# Altium project Kanaloa_v2.0.0_Motor.PrjPcb
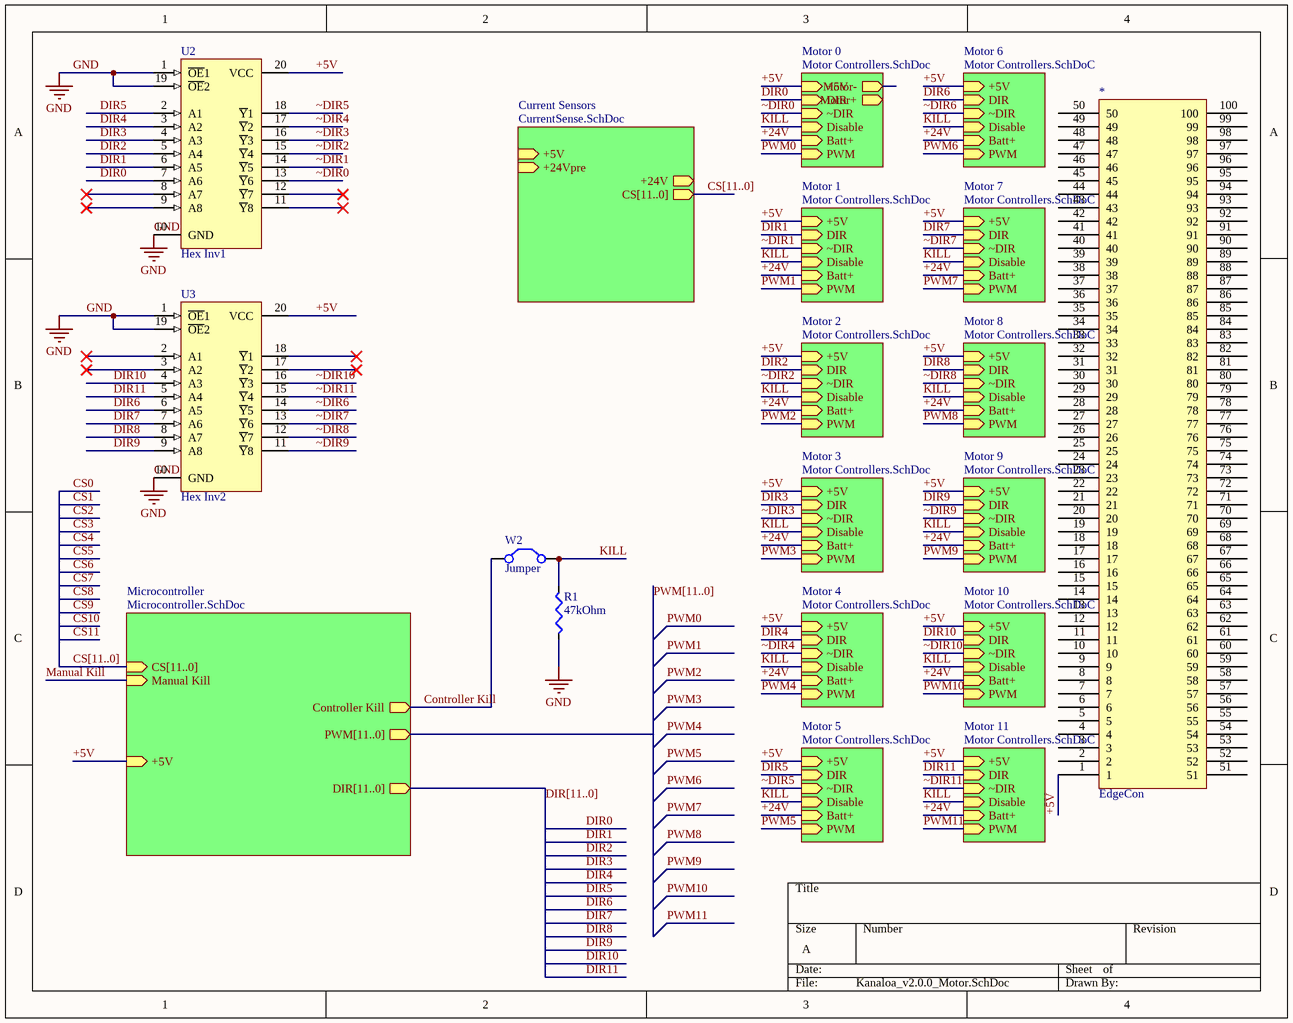
[diagram p0: Kanaloa_v2.0.0_Motor.SchDoc]
4 sheets, 223 parts. Net scope: hierarchical (ports join the sheet entries above them; power ports are global).
Board file: Kanaloa_v2.0.0_Motor.PcbDoc
Sheets:
  Kanaloa_v2.0.0_Motor.SchDoc
    Microcontroller = Microcontroller.SchDoc
    Current Sensors = CurrentSense.SchDoc
    Motor 0 = Motor Controllers.SchDoc
    Motor 6 = Motor Controllers.SchDoc
    Motor 1 = Motor Controllers.SchDoc
    Motor 7 = Motor Controllers.SchDoc
    Motor 2 = Motor Controllers.SchDoc
    Motor 8 = Motor Controllers.SchDoc
    Motor 3 = Motor Controllers.SchDoc
    Motor 9 = Motor Controllers.SchDoc
    Motor 4 = Motor Controllers.SchDoc
    Motor 10 = Motor Controllers.SchDoc
    Motor 5 = Motor Controllers.SchDoc
    Motor 11 = Motor Controllers.SchDoc

## Sheet Kanaloa_v2.0.0_Motor.SchDoc
size A

### Parts
*  EdgeCon  [5645235-3 CON]
R1  47kOhm  [R 1210 (3225) RESISTOR]
U2  Hex Inv1  [DW020_N]
U3  Hex Inv2  [DW020_N]
W2  Jumper  [RAD-0.2]

### Sub-sheets
Current Sensors = CurrentSense.SchDoc: +5V (in), +24Vpre (in), +24V (out), CS[11..0] (out)
Microcontroller = Microcontroller.SchDoc: PWM[11..0] (out), DIR[11..0] (out), +5V (in), Controller Kill (out), Manual Kill (in), CS[11..0] (in)
Motor 0 = Motor Controllers.SchDoc: +5V (in), DIR (in), ~DIR (in), Disable (in), Batt+ (in), PWM (in), Motor- (out), Motor+ (out)
Motor 1 = Motor Controllers.SchDoc: +5V (in), DIR (in), ~DIR (in), Disable (in), Batt+ (in), PWM (in)
Motor 2 = Motor Controllers.SchDoc: +5V (in), DIR (in), ~DIR (in), Disable (in), Batt+ (in), PWM (in)
Motor 3 = Motor Controllers.SchDoc: +5V (in), DIR (in), ~DIR (in), Disable (in), Batt+ (in), PWM (in)
Motor 4 = Motor Controllers.SchDoc: +5V (in), DIR (in), ~DIR (in), Disable (in), Batt+ (in), PWM (in)
Motor 5 = Motor Controllers.SchDoc: +5V (in), DIR (in), ~DIR (in), Disable (in), Batt+ (in), PWM (in)
Motor 6 = Motor Controllers.SchDoC: +5V (in), DIR (in), ~DIR (in), Disable (in), Batt+ (in), PWM (in)
Motor 7 = Motor Controllers.SchDoC: +5V (in), DIR (in), ~DIR (in), Disable (in), Batt+ (in), PWM (in)
Motor 8 = Motor Controllers.SchDoC: +5V (in), DIR (in), ~DIR (in), Disable (in), Batt+ (in), PWM (in)
Motor 9 = Motor Controllers.SchDoC: +5V (in), DIR (in), ~DIR (in), Disable (in), Batt+ (in), PWM (in)
Motor 10 = Motor Controllers.SchDoC: +5V (in), DIR (in), ~DIR (in), Disable (in), Batt+ (in), PWM (in)
Motor 11 = Motor Controllers.SchDoC: +5V (in), DIR (in), ~DIR (in), Disable (in), Batt+ (in), PWM (in)

### Nets
GND: R1.1 U2.1(~{OE}1) U2.10(GND) U2.19(~{OE}2) U3.1(~{OE}1) U3.10(GND) U3.19(~{OE}2)  [project net +5V]
+5V: *.1 U2.20(VCC) U3.20(VCC) ; sheet Microcontroller/+5V, sheet Motor 0/+5V, sheet Motor 6/+5V, sheet Motor 1/+5V, sheet Motor 7/+5V, sheet Motor 2/+5V, sheet Motor 8/+5V, sheet Motor 3/+5V, sheet Motor 9/+5V, sheet Motor 4/+5V, sheet Motor 10/+5V, sheet Motor 5/+5V, sheet Motor 11/+5V
+24V: sheet Motor 0/Batt+, sheet Motor 6/Batt+, sheet Motor 1/Batt+, sheet Motor 7/Batt+, sheet Motor 2/Batt+, sheet Motor 8/Batt+, sheet Motor 3/Batt+, sheet Motor 9/Batt+, sheet Motor 4/Batt+, sheet Motor 10/Batt+, sheet Motor 5/Batt+, sheet Motor 11/Batt+
Controller Kill: W2.1(C1) ; sheet Microcontroller/Controller Kill
DIR0: U2.7(A6) ; sheet Motor 0/DIR
DIR1: U2.6(A5) ; sheet Motor 1/DIR
DIR2: U2.5(A4) ; sheet Motor 2/DIR
DIR3: U2.4(A3) ; sheet Motor 3/DIR
DIR4: U2.3(A2) ; sheet Motor 4/DIR
DIR5: U2.2(A1) ; sheet Motor 5/DIR
DIR6: U3.6(A5) ; sheet Motor 6/DIR
DIR7: U3.7(A6) ; sheet Motor 7/DIR
DIR8: U3.8(A7) ; sheet Motor 8/DIR
DIR9: U3.9(A8) ; sheet Motor 9/DIR
DIR10: U3.4(A3) ; sheet Motor 10/DIR
DIR11: U3.5(A4) ; sheet Motor 11/DIR
KILL: R1.2 W2.2(C2) ; sheet Motor 0/Disable, sheet Motor 6/Disable, sheet Motor 1/Disable, sheet Motor 7/Disable, sheet Motor 2/Disable, sheet Motor 8/Disable, sheet Motor 3/Disable, sheet Motor 9/Disable, sheet Motor 4/Disable, sheet Motor 10/Disable, sheet Motor 5/Disable, sheet Motor 11/Disable
Manual Kill: sheet Microcontroller/Manual Kill
PWM0: sheet Motor 0/PWM
PWM1: sheet Motor 1/PWM
PWM2: sheet Motor 2/PWM
PWM3: sheet Motor 3/PWM
PWM4: sheet Motor 4/PWM
PWM5: sheet Motor 5/PWM
PWM6: sheet Motor 6/PWM
PWM7: sheet Motor 7/PWM
PWM8: sheet Motor 8/PWM
PWM9: sheet Motor 9/PWM
PWM10: sheet Motor 10/PWM
PWM11: sheet Motor 11/PWM
~DIR0: U2.13(~{Y}6) ; sheet Motor 0/~DIR
~DIR1: U2.14(~{Y}5) ; sheet Motor 1/~DIR
~DIR2: U2.15(~{Y}4) ; sheet Motor 2/~DIR
~DIR3: U2.16(~{Y}3) ; sheet Motor 3/~DIR
~DIR4: U2.17(~{Y}2) ; sheet Motor 4/~DIR
~DIR5: U2.18(~{Y}1) ; sheet Motor 5/~DIR
~DIR6: U3.14(~{Y}5) ; sheet Motor 6/~DIR
~DIR7: U3.13(~{Y}6) ; sheet Motor 7/~DIR
~DIR8: U3.12(~{Y}7) ; sheet Motor 8/~DIR
~DIR9: U3.11(~{Y}8) ; sheet Motor 9/~DIR
~DIR10: U3.16(~{Y}3) ; sheet Motor 10/~DIR
~DIR11: U3.15(~{Y}4) ; sheet Motor 11/~DIR

Not connected (* = marked no-connect by the designer): * 2 3 4 5 6 7 8 9 10 11 12 13 14 15 16 17 18 19 20 21 22 23 24 25 26 27 28 29 30 31 32 33 34 35 36 37 38 39 40 41 42 43 44 45 46 47 48 49 50 51 52 53 54 55 56 57 58 59 60 61 62 63 64 65 66 67 68 69 70 71 72 73 74 75 76 77 78 79 80 81 82 83 84 85 86 87 88 89 90 91 92 93 94 95 96 97 98 99 100; U2 8(A7)* 9(A8)* 11(~{Y}8)* 12(~{Y}7)*; U3 2(A1)* 3(A2)* 17(~{Y}2)* 18(~{Y}1)*

### Buses and harness runs
bus CS[11..0] = sheet Current Sensors/CS[11..0]
bus CS[11..0] = sheet Microcontroller/CS[11..0]
bus DIR[11..0] = sheet Microcontroller/DIR[11..0]
bus PWM[11..0] = sheet Microcontroller/PWM[11..0]

### Library data of the parts
R1 = Resistor: Value: 0Ohm
U2 U3 = SN74HCT540DW: Octal Buffer and Line Driver with 3-State Outputs; Published: 8-Jun-2000; LatestRevisionDate: 13-Apr-2006; LatestRevisionNote: IPC-7351 Footprint Added.; DatasheetVersion: May-1997; PackageVersion: Mar-2000; PackageReference: DW020; Publisher: Altium Limited; PackageDescription: 20-Pin Plastic Small Outline Integrated Circuit 1.27 mm Pitch; Code_JEDEC: MS-013; Code_IPC: SOIC127P1030-20; ComponentLink1Description: Manufacturer Link; ComponentLink1URL: http://www.ti.com/; ComponentLink2Description: Datasheet; ComponentLink2URL: http://www-s.ti.com/sc/ds/sn74hct540.pdf
W2 = Jumper: Jumper Wire; Published: 24-Mar-1999; LatestRevisionDate: 17-Jul-2002; LatestRevisionNote: Re-released for DXP Platform.; PackageReference: RAD-0.2; Publisher: Altium Limited

## Sheet Microcontroller.SchDoc
size A
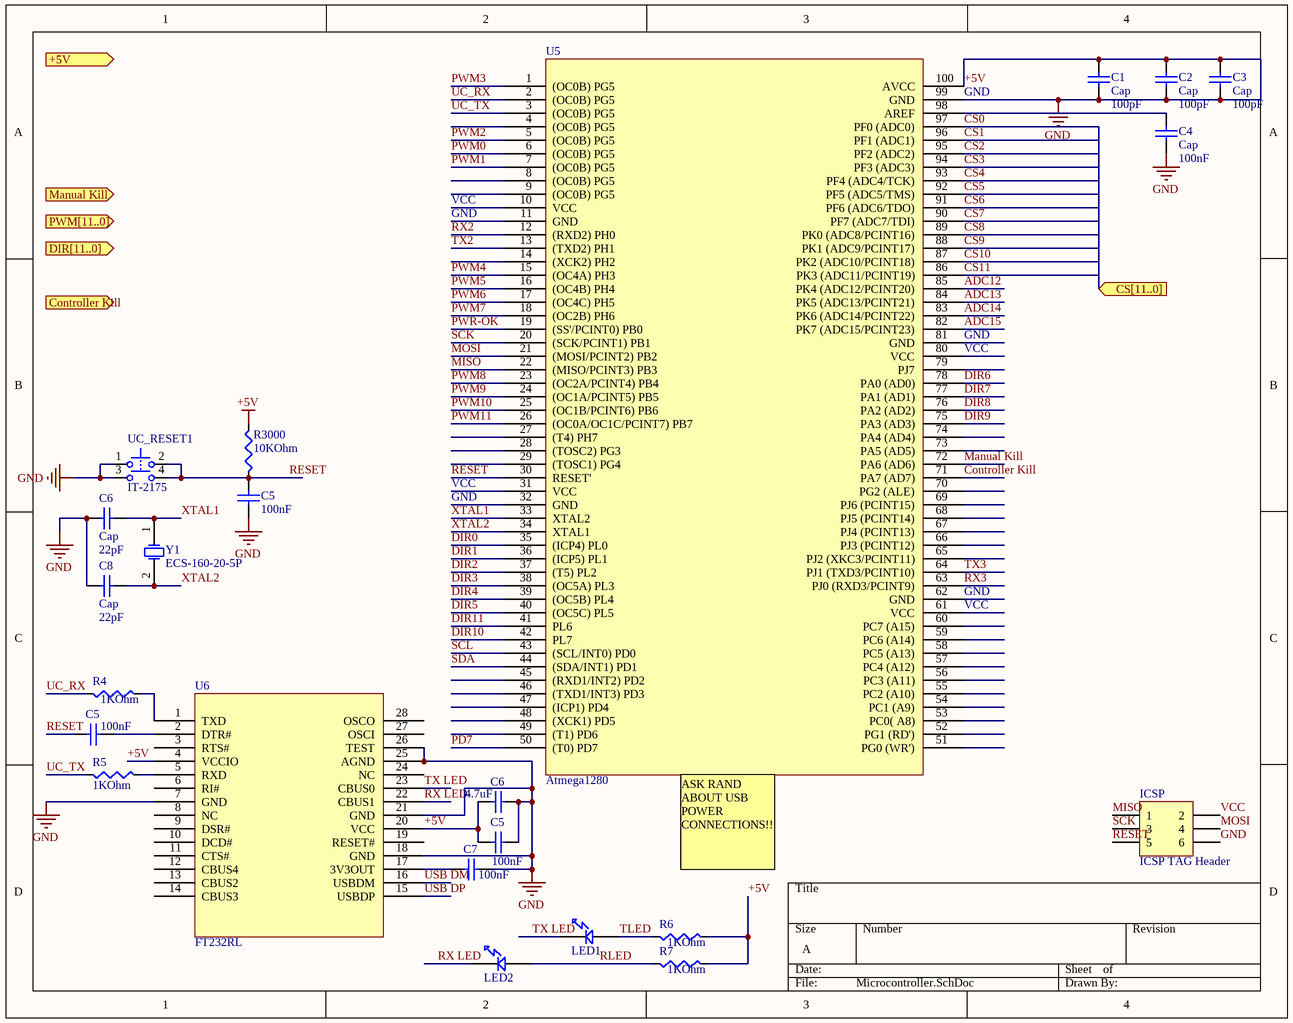
[diagram p1: Microcontroller.SchDoc]

### Parts
(Parts that share a designator on the sheet are numbered #1, #2 ... from top to bottom, then left to right.)
C1  Cap  value 100pF  [0805 (2012) Capacitor]
C2  Cap  value 100pF  [0805 (2012) Capacitor]
C3  Cap  value 100pF  [0805 (2012) Capacitor]
C4  Cap  value 100nF  [0805 (2012) Capacitor]
C5#1  100nF  [0805 (2012) Capacitor]
C5#2  100nF  [0805 (2012) Capacitor]
C5#3  100nF  [0805 (2012) Capacitor]
C6#1  Cap  value 22pF  [0805 (2012) Capacitor]
C6#2  4.7uF  [0805 (2012) Capacitor]
C7  100nF  [0805 (2012) Capacitor]
C8  Cap  value 22pF  [0805 (2012) Capacitor]
ICSP  ICSP TAG Header  [HDR2X3]
LED1  LED  [LED 0805]  (value not drawn)
LED2#1  LED  [LED 0805]  (value not drawn)
R4  1KOhm  [R 0805 (2012) RESISTOR]
R5  1KOhm  [R 0805 (2012) RESISTOR]
R6  1KOhm  [R 0805 (2012) RESISTOR]
R7  1KOhm  [R 0805 (2012) RESISTOR]
R3000  10KOhm  [R 0805 (2012) RESISTOR]
U5  Atmega1280  [TSQFP50P1600X1600X120-100N]
U6  FT232RL  [SOP65P780X200-28N]
UC_RESET1  IT-2175  [IT-2175]
Y1  ECS-160-20-5P  [CSM-7]

### Ports
+5V (in), Controller Kill (out), CS[11..0] (in), DIR[11..0] (out), Manual Kill (in), PWM[11..0] (out)

### Nets
+5V: C1.1 C1.2 C2.1 C2.2 C3.1 C3.2 C4.1 C5#1.1 C5#3.1 C5#3.2 C6#1.1 C6#2.1 C6#2.2 C7.2 C8.1 ICSP.6 R6.2 R7.2 R3000.1 U5.11(GND) U5.32(GND) U5.62(GND) U5.81(GND) U5.99(GND) U5.100(AVCC) U6.4(VCCIO) U6.7(GND) U6.18(GND) U6.20(VCC) U6.21(GND) U6.25(AGND) U6.26(TEST) UC_RESET1.1 UC_RESET1.3  [also labelled GND]
ADC12: U5.85(PK4_(ADC12/PCINT20))
ADC13: U5.84(PK5_(ADC13/PCINT21))
ADC14: U5.83(PK6_(ADC14/PCINT22))
ADC15: U5.82(PK7_(ADC15/PCINT23))
Controller Kill: U5.71(PA7_(AD7))
CS0: U5.97(PF0_(ADC0))
CS1: U5.96(PF1_(ADC1))
CS2: U5.95(PF2_(ADC2))
CS3: U5.94(PF3_(ADC3))
CS4: U5.93(PF4_(ADC4/TCK))
CS5: U5.92(PF5_(ADC5/TMS))
CS6: U5.91(PF6_(ADC6/TDO))
CS7: U5.90(PF7_(ADC7/TDI))
CS8: U5.89(PK0_(ADC8/PCINT16))
CS9: U5.88(PK1_(ADC9/PCINT17))
CS10: U5.87(PK2_(ADC10/PCINT18))
CS11: U5.86(PK3_(ADC11/PCINT19))
DIR0: U5.35((ICP4)_PL0)
DIR1: U5.36((ICP5)_PL1)
DIR2: U5.37((T5)_PL2)
DIR3: U5.38((OC5A)_PL3)
DIR4: U5.39((OC5B)_PL4)
DIR5: U5.40((OC5C)_PL5)
DIR6: U5.78(PA0_(AD0))
DIR7: U5.77(PA1_(AD1))
DIR8: U5.76(PA2_(AD2))
DIR9: U5.75(PA3_(AD3))
DIR10: U5.42(PL7)
DIR11: U5.41(PL6)
Manual Kill: U5.72(PA6_(AD6))
MISO: ICSP.1 U5.22((MISO/PCINT3)_PB3)
MOSI: ICSP.4 U5.21((MOSI/PCINT2)_PB2)
PD7: U5.50((T0)_PD7)
PWM0: U5.6((OC0B)_PG5)
PWM1: U5.7((OC0B)_PG5)
PWM2: U5.5((OC0B)_PG5)
PWM3: U5.1((OC0B)_PG5)
PWM4: U5.15((OC4A)_PH3)
PWM5: U5.16((OC4B)_PH4)
PWM6: U5.17((OC4C)_PH5)
PWM7: U5.18((OC2B)_PH6)
PWM8: U5.23((OC2A/PCINT4)_PB4)
PWM9: U5.24((OC1A/PCINT5)_PB5)
PWM10: U5.25((OC1B/PCINT6)_PB6)
PWM11: U5.26((OC0A/OC1C/PCINT7)_PB7)
PWR-OK: U5.19((SS'/PCINT0)_PB0)
RESET: C5#1.2 C5#2.1 ICSP.5 R3000.2 U5.30(RESET') UC_RESET1.2 UC_RESET1.4
RLED: LED2#1.2 R7.1
RX2: U5.12((RXD2)_PH0)
RX3: U5.63(PJ0_(RXD3/PCINT9))
RX LED: LED2#1.1 U6.22(CBUS1)
SCK: ICSP.3 U5.20((SCK/PCINT1)_PB1)
SCL: U5.43((SCL/INT0)_PD0)
SDA: U5.44((SDA/INT1)_PD1)
TLED: LED1.2 R6.1
TX2: U5.13((TXD2)_PH1)
TX3: U5.64(PJ1_(TXD3/PCINT10))
TX LED: LED1.1 U6.23(CBUS0)
UC_RX: R4.1 U5.2((OC0B)_PG5)
UC_TX: R5.1 U5.3((OC0B)_PG5)
USB DM: U6.16(USBDM)
USB DP: U6.15(USBDP)
VCC: ICSP.2 U5.10(VCC) U5.31(VCC) U5.61(VCC) U5.80(VCC)
XTAL1: C6#1.2 U5.33(XTAL2) Y1.1(OSC1)
XTAL2: C8.2 U5.34(XTAL1) Y1.2(OSC2)
NetC4_2: C4.2 U5.98(AREF)
NetC5#2_2: C5#2.2 U6.2(DTR#)
NetC7_1: C7.1 U6.17(3V3OUT)
NetR4_2: R4.2 U6.1(TXD)
NetR5_2: R5.2 U6.5(RXD)

Not connected (* = marked no-connect by the designer): U5 4((OC0B)_PG5) 8((OC0B)_PG5) 9((OC0B)_PG5) 14((XCK2)_PH2) 27((T4)_PH7) 28((TOSC2)_PG3) 29((TOSC1)_PG4) 45((RXD1/INT2)_PD2) 46((TXD1/INT3)_PD3) 47((ICP1)_PD4) 48((XCK1)_PD5) 49((T1)_PD6) 51(PG0_(WR')) 52(PG1_(RD')) 53(PC0(_A8)) 54(PC1_(A9)) 55(PC2_(A10)) 56(PC3_(A11)) 57(PC4_(A12)) 58(PC5_(A13)) 59(PC6_(A14)) 60(PC7_(A15)) 65(PJ2_(XKC3/PCINT11)) 66(PJ3_(PCINT12)) 67(PJ4_(PCINT13)) 68(PJ5_(PCINT14)) 69(PJ6_(PCINT15)) 70(PG2_(ALE)) 73(PA5_(AD5)) 74(PA4_(AD4)) 79(PJ7); U6 3(RTS#) 6(RI#) 8(NC) 9(DSR#) 10(DCD#) 11(CTS#) 12(CBUS4) 13(CBUS2) 14(CBUS3) 19(RESET#) 24(NC) 27(OSCI) 28(OSCO)

### Notes on the sheet
- (near U5) ASK RAND ABOUT USB POWER CONNECTIONS!!

### Library data of the parts
C1-C4 C6#1 C8 = Cap: Capacitor; Published: 8-Jun-2000; LatestRevisionDate: 17-Jul-2002; LatestRevisionNote: Re-released for DXP Platform.; PackageReference: RAD-0.3; Publisher: Altium Limited
C5#1-C5#3 C6#2 C7 = Capacitor (non-polarized): Capacitor; Value: .1uF
ICSP = Header 3X2: Header, 3-Pin, Dual row; LatestRevisionDate: 17-Jul-2002; LatestRevisionNote: Re-released for DXP Platform.; Publisher: Altium Limited
LED1 LED2#1 = LED: Standard LED
R4-R7 R3000 = Resistor: Value: 0Ohm
UC_RESET1 = IT-2175: Tactile Switch, DPST; Thru-Hole; Vertical; Rating DC 12V, 50mA (max); PackageDocument: Rev.0; Published: 6-Jun-2005; DatasheetDocument: Rev.0; PackageReference: IT-2175; Publisher: Altium Limited; ComponentLink1Description: Manufacturer Link; ComponentLink1URL: http://www.ilswitch.com/; ComponentLink2Description: Device Overview; ComponentLink2URL: http://www.ilswitch.com/list.php?ac_id=010112&ai_id=91
Y1 = ECS-120-32-1: Crystal Oscillator; Published: 17-Jul-2002; DatasheetDocument: 18-Apr-2000; PackageReference: HC-49U; Publisher: Altium Limited; ComponentLink1Description: Manufacturer Link; ComponentLink1URL: http://www.ecsxtal.com/; ComponentLink2Description: Datasheet; ComponentLink2URL: http://www.ecsxtal.com/pdf2/HC49U.PDF

## Sheet CurrentSense.SchDoc
size A
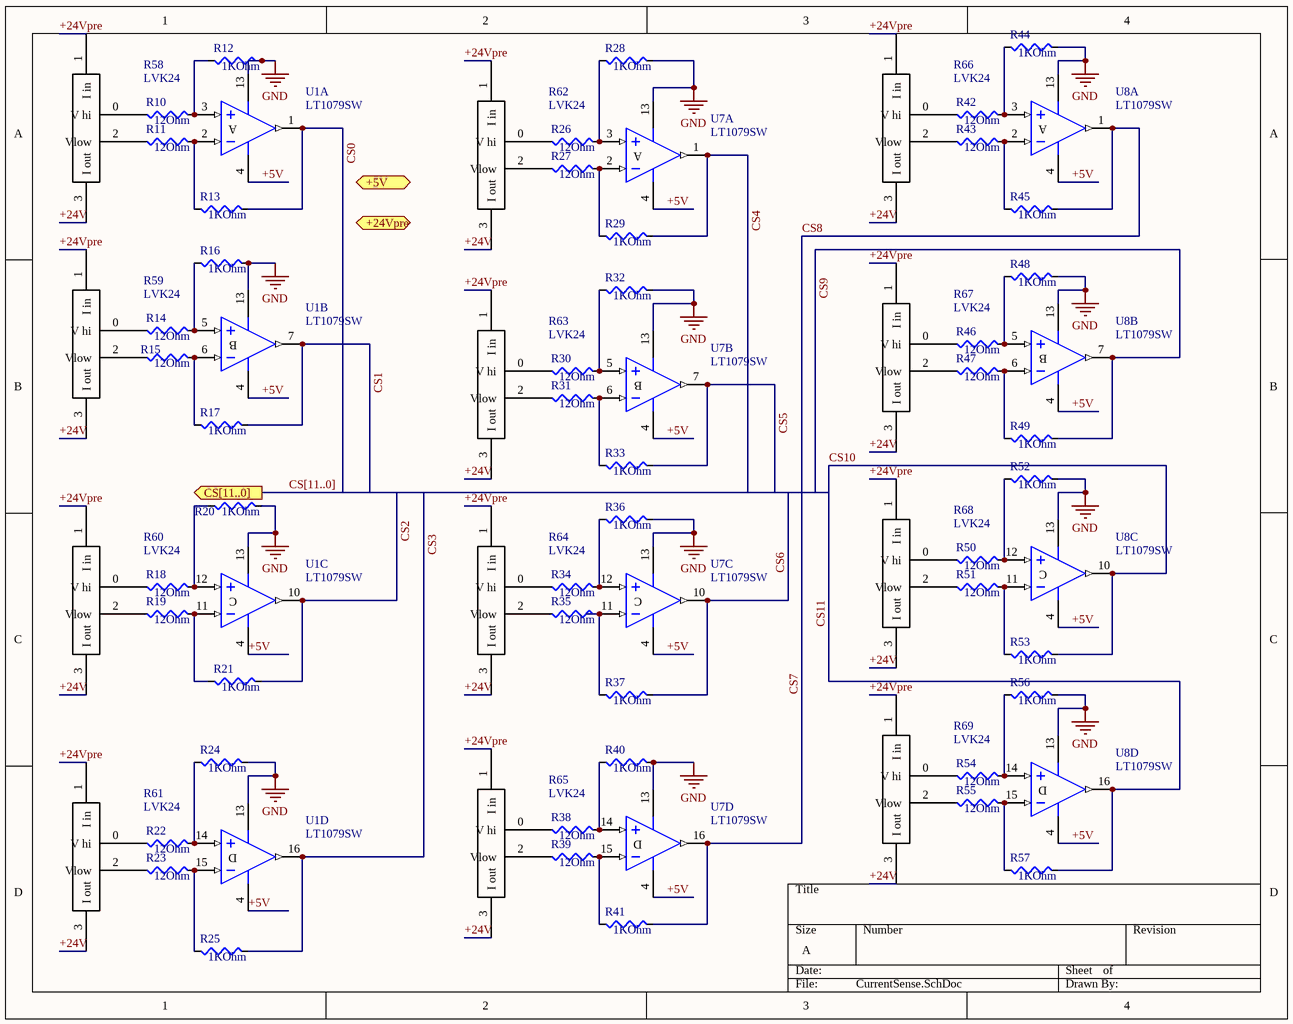
[diagram p2: CurrentSense.SchDoc]

### Parts
R10  12Ohm  [R 0805 (2012) RESISTOR]
R11  12Ohm  [R 0805 (2012) RESISTOR]
R12  1KOhm  [R 0805 (2012) RESISTOR]
R13  1KOhm  [R 0805 (2012) RESISTOR]
R14  12Ohm  [R 0805 (2012) RESISTOR]
R15  12Ohm  [R 0805 (2012) RESISTOR]
R16  1KOhm  [R 0805 (2012) RESISTOR]
R17  1KOhm  [R 0805 (2012) RESISTOR]
R18  12Ohm  [R 0805 (2012) RESISTOR]
R19  12Ohm  [R 0805 (2012) RESISTOR]
R20  1KOhm  [R 0805 (2012) RESISTOR]
R21  1KOhm  [R 0805 (2012) RESISTOR]
R22  12Ohm  [R 0805 (2012) RESISTOR]
R23  12Ohm  [R 0805 (2012) RESISTOR]
R24  1KOhm  [R 0805 (2012) RESISTOR]
R25  1KOhm  [R 0805 (2012) RESISTOR]
R26  12Ohm  [R 0805 (2012) RESISTOR]
R27  12Ohm  [R 0805 (2012) RESISTOR]
R28  1KOhm  [R 0805 (2012) RESISTOR]
R29  1KOhm  [R 0805 (2012) RESISTOR]
R30  12Ohm  [R 0805 (2012) RESISTOR]
R31  12Ohm  [R 0805 (2012) RESISTOR]
R32  1KOhm  [R 0805 (2012) RESISTOR]
R33  1KOhm  [R 0805 (2012) RESISTOR]
R34  12Ohm  [R 0805 (2012) RESISTOR]
R35  12Ohm  [R 0805 (2012) RESISTOR]
R36  1KOhm  [R 0805 (2012) RESISTOR]
R37  1KOhm  [R 0805 (2012) RESISTOR]
R38  12Ohm  [R 0805 (2012) RESISTOR]
R39  12Ohm  [R 0805 (2012) RESISTOR]
R40  1KOhm  [R 0805 (2012) RESISTOR]
R41  1KOhm  [R 0805 (2012) RESISTOR]
R42  12Ohm  [R 0805 (2012) RESISTOR]
R43  12Ohm  [R 0805 (2012) RESISTOR]
R44  1KOhm  [R 0805 (2012) RESISTOR]
R45  1KOhm  [R 0805 (2012) RESISTOR]
R46  12Ohm  [R 0805 (2012) RESISTOR]
R47  12Ohm  [R 0805 (2012) RESISTOR]
R48  1KOhm  [R 0805 (2012) RESISTOR]
R49  1KOhm  [R 0805 (2012) RESISTOR]
R50  12Ohm  [R 0805 (2012) RESISTOR]
R51  12Ohm  [R 0805 (2012) RESISTOR]
R52  1KOhm  [R 0805 (2012) RESISTOR]
R53  1KOhm  [R 0805 (2012) RESISTOR]
R54  12Ohm  [R 0805 (2012) RESISTOR]
R55  12Ohm  [R 0805 (2012) RESISTOR]
R56  1KOhm  [R 0805 (2012) RESISTOR]
R57  1KOhm  [R 0805 (2012) RESISTOR]
R58  LVK24  [LVK24 Ohmite]
R59  LVK24  [LVK24 Ohmite]
R60  LVK24  [LVK24 Ohmite]
R61  LVK24  [LVK24 Ohmite]
R62  LVK24  [LVK24 Ohmite]
R63  LVK24  [LVK24 Ohmite]
R64  LVK24  [LVK24 Ohmite]
R65  LVK24  [LVK24 Ohmite]
R66  LVK24  [LVK24 Ohmite]
R67  LVK24  [LVK24 Ohmite]
R68  LVK24  [LVK24 Ohmite]
R69  LVK24  [LVK24 Ohmite]
U1  LT1079SW  [SW16_N]  (parts A,B,C,D of 4)
U7  LT1079SW  [SW16_N]  (parts A,B,C,D of 4)
U8  LT1079SW  [SW16_N]  (parts A,B,C,D of 4)

### Ports
+5V, +24Vpre, CS[11..0] (out)

### Nets
GND: R12.2 R16.2 R20.2 R24.2 R28.2 R32.2 R36.2 R40.2 R44.2 R48.2 R52.2 R56.2 U1.13(V-) U7.13(V-) U8.13(V-)  [project net +5V]
+5V: U1.4(V+) U7.4(V+) U8.4(V+)
+24V: R58.3(I_out) R59.3(I_out) R60.3(I_out) R61.3(I_out) R62.3(I_out) R63.3(I_out) R64.3(I_out) R65.3(I_out) R66.3(I_out) R67.3(I_out) R68.3(I_out) R69.3(I_out)
+24Vpre: R58.1(I_in) R59.1(I_in) R60.1(I_in) R61.1(I_in) R62.1(I_in) R63.1(I_in) R64.1(I_in) R65.1(I_in) R66.1(I_in) R67.1(I_in) R68.1(I_in) R69.1(I_in)
CS0: R13.2 U1.1(OUT)
CS1: R17.2 U1.7(OUT)
CS2: R21.2 U1.10(OUT)
CS3: R25.2 U1.16(OUT)
CS4: R29.2 U7.1(OUT)
CS5: R33.2 U7.7(OUT)
CS6: R37.2 U7.10(OUT)
CS7: R41.2 R45.2 U7.16(OUT) U8.1(OUT)  [also labelled CS8]
CS9: R49.2 U8.7(OUT)
CS10: R53.2 R57.2 U8.10(OUT) U8.16(OUT)  [also labelled CS11]
NetR10_1: R10.1 R58.0(V_hi)
NetR10_2: R10.2 R12.1 U1.3(IN+)
NetR11_1: R11.1 R58.2(Vlow)
NetR11_2: R11.2 R13.1 U1.2(IN-)
NetR14_1: R14.1 R59.0(V_hi)
NetR14_2: R14.2 R16.1 U1.5(IN+)
NetR15_1: R15.1 R59.2(Vlow)
NetR15_2: R15.2 R17.1 U1.6(IN-)
NetR18_1: R18.1 R60.0(V_hi)
NetR18_2: R18.2 R20.1 U1.12(IN+)
NetR19_1: R19.1 R60.2(Vlow)
NetR19_2: R19.2 R21.1 U1.11(IN-)
NetR22_1: R22.1 R61.0(V_hi)
NetR22_2: R22.2 R24.1 U1.14(IN+)
NetR23_1: R23.1 R61.2(Vlow)
NetR23_2: R23.2 R25.1 U1.15(IN-)
NetR26_1: R26.1 R62.0(V_hi)
NetR26_2: R26.2 R28.1 U7.3(IN+)
NetR27_1: R27.1 R62.2(Vlow)
NetR27_2: R27.2 R29.1 U7.2(IN-)
NetR30_1: R30.1 R63.0(V_hi)
NetR30_2: R30.2 R32.1 U7.5(IN+)
NetR31_1: R31.1 R63.2(Vlow)
NetR31_2: R31.2 R33.1 U7.6(IN-)
NetR34_1: R34.1 R64.0(V_hi)
NetR34_2: R34.2 R36.1 U7.12(IN+)
NetR35_1: R35.1 R64.2(Vlow)
NetR35_2: R35.2 R37.1 U7.11(IN-)
NetR38_1: R38.1 R65.0(V_hi)
NetR38_2: R38.2 R40.1 U7.14(IN+)
NetR39_1: R39.1 R65.2(Vlow)
NetR39_2: R39.2 R41.1 U7.15(IN-)
NetR42_1: R42.1 R66.0(V_hi)
NetR42_2: R42.2 R44.1 U8.3(IN+)
NetR43_1: R43.1 R66.2(Vlow)
NetR43_2: R43.2 R45.1 U8.2(IN-)
NetR46_1: R46.1 R67.0(V_hi)
NetR46_2: R46.2 R48.1 U8.5(IN+)
NetR47_1: R47.1 R67.2(Vlow)
NetR47_2: R47.2 R49.1 U8.6(IN-)
NetR50_1: R50.1 R68.0(V_hi)
NetR50_2: R50.2 R52.1 U8.12(IN+)
NetR51_1: R51.1 R68.2(Vlow)
NetR51_2: R51.2 R53.1 U8.11(IN-)
NetR54_1: R54.1 R69.0(V_hi)
NetR54_2: R54.2 R56.1 U8.14(IN+)
NetR55_1: R55.1 R69.2(Vlow)
NetR55_2: R55.2 R57.1 U8.15(IN-)

### Buses and harness runs
bus CS[11..0] = port CS[11..0]

### Notes on the sheet
- (in symbol LT1079SW, part A) A
- (in symbol LT1079SW, part B) B
- (in symbol LT1079SW, part C) C
- (in symbol LT1079SW, part D) D

### Library data of the parts
R10-R57 = Resistor: Value: 0Ohm
U1 U7 U8 = LT1079SW: Micropower, Quad, Single Supply, Precision Operational Amplifier; Note: Pins 8 and 9 are NC (not internally connected) pins and are not drawn.; Note: 436; Published: 8-Jun-2000; LatestRevisionDate: 13-Apr-2006; LatestRevisionNote: IPC-7351 Footprint Added.; DatasheetVersion: 1996; PackageVersion: S16 (WIDE) 0502; PackageReference: SW16; Publisher: Altium Limited; PackageDescription: 16-Pin Plastic Small Outline Integrated Circuit 1.27 mm Pitch; Code_JEDEC: MS-013-AA; Code_IPC: SOIC127P1030-16; ComponentLink1Description: Manufacturer Link; ComponentLink1URL: http://www.linear.com/; ComponentLink2Description: Datasheet; ComponentLink2URL: http://www.linear.com/pc/downloadDocument.do?navId=H0,C1,C1154,C1009,C1099,P1277,D1716

## Sheet Motor Controllers.SchDoc
size A
Used 12 times, as channels Motor 0, Motor 6, Motor 1, Motor 7, Motor 2, Motor 8, Motor 3, Motor 9, Motor 4, Motor 10, Motor 5, Motor 11. Parts and nets are listed once, with the designators drawn on the sheet.
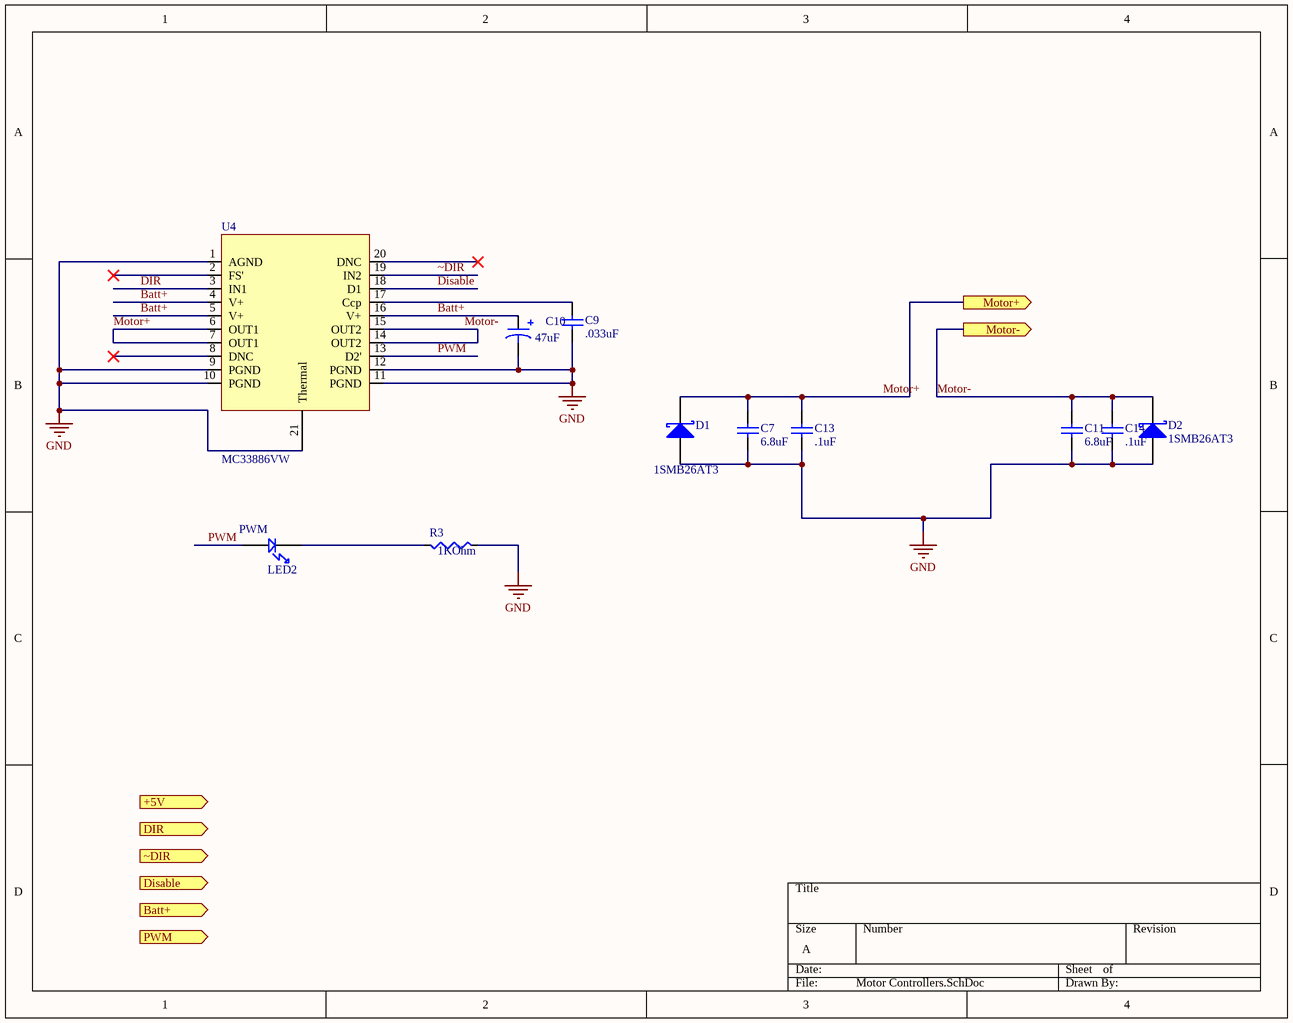
[diagram p3: Motor Controllers.SchDoc]

### Parts
C7  6.8uF  [1210 (3225) Capacitor]
C9  .033uF  [0805 (2012) Capacitor]
C10  47uF  [Radial_6.3mmDia_SM_D]
C11  6.8uF  [1210 (3225) Capacitor]
C13  .1uF  [0805 (2012) Capacitor]
C14  .1uF  [0805 (2012) Capacitor]
D1  1SMB26AT3  [SMB]
D2  1SMB26AT3  [SMB]
LED2  PWM  [LED 0805]
R3  1KOhm  [R 0805 (2012) RESISTOR]
U4  MC33886VW  [SOP127P1420X340_HS-20N]

### Ports
+5V (in), Batt+ (in), DIR (in), Disable (in), Motor+ (out), Motor- (out), PWM (in), ~DIR (in)

### Nets
GND: C7.1 C9.1 C10.N C11.1 C13.1 C14.1 D1.1(A) D2.1(A) R3.2 U4.1(AGND) U4.9(PGND) U4.10(PGND) U4.11(PGND) U4.12(PGND) U4.21(Thermal)
Batt+: C10.P U4.4(V+) U4.5(V+) U4.16(V+)
DIR: U4.3(IN1)
Disable: U4.18(D1)
Motor+: C7.2 C13.2 D1.2(K) U4.6(OUT1) U4.7(OUT1) ; port Motor+
Motor-: C11.2 C14.2 D2.2(K) U4.14(OUT2) U4.15(OUT2) ; port Motor-
PWM: LED2.2 U4.13(D2')
~DIR: U4.19(IN2)
NetC9_2: C9.2 U4.17(Ccp)
NetLED2_1: LED2.1 R3.1

Not connected (* = marked no-connect by the designer): U4 2(FS')* 8(DNC)* 20(DNC)*

### Channels
Motor 0: designators C7=C7_0 C9=C9_0 C10=C10_0 C11=C11_Motor_0 C13=C13_0 C14=C14_0 D1=D1 D2=D2 LED2=LED2#2 R3=R3 U4=U4_Motor_0; ports +5V=+5V Batt+=+24V DIR=DIR0 Disable=KILL Motor+=Motor+_Motor 0 Motor-=Motor-_Motor 0 PWM=PWM0 ~DIR=~DIR0
Motor 6: designators end in _Motor_6; ports +5V=+5V Batt+=+24V DIR=DIR6 Disable=KILL Motor+=Motor+_Motor 6 Motor-=Motor-_Motor 6 PWM=PWM6 ~DIR=~DIR6
Motor 1: designators C7=C7_Motor_1 C9=C9_Motor_1 C10=C10 C11=C11_Motor_1 C13=C13_Motor_1 C14=C14_Motor_1 D1=D1_Motor_1 D2=D2_Motor_1 LED2=LED2_Motor_1 R3=R3_Motor_1 U4=U4_Motor_1; ports +5V=+5V Batt+=+24V DIR=DIR1 Disable=KILL Motor+=Motor+_Motor 1 Motor-=Motor-_Motor 1 PWM=PWM1 ~DIR=~DIR1
Motor 7: designators end in _Motor_7; ports +5V=+5V Batt+=+24V DIR=DIR7 Disable=KILL Motor+=Motor+_Motor 7 Motor-=Motor-_Motor 7 PWM=PWM7 ~DIR=~DIR7
Motor 2: designators end in _Motor_2; ports +5V=+5V Batt+=+24V DIR=DIR2 Disable=KILL Motor+=Motor+_Motor 2 Motor-=Motor-_Motor 2 PWM=PWM2 ~DIR=~DIR2
Motor 8: designators end in _Motor_8; ports +5V=+5V Batt+=+24V DIR=DIR8 Disable=KILL Motor+=Motor+_Motor 8 Motor-=Motor-_Motor 8 PWM=PWM8 ~DIR=~DIR8
Motor 3: designators end in _Motor_3; ports +5V=+5V Batt+=+24V DIR=DIR3 Disable=KILL Motor+=Motor+_Motor 3 Motor-=Motor-_Motor 3 PWM=PWM3 ~DIR=~DIR3
Motor 9: designators end in _Motor_9; ports +5V=+5V Batt+=+24V DIR=DIR9 Disable=KILL Motor+=Motor+_Motor 9 Motor-=Motor-_Motor 9 PWM=PWM9 ~DIR=~DIR9
Motor 4: designators end in _Motor_4; ports +5V=+5V Batt+=+24V DIR=DIR4 Disable=KILL Motor+=Motor+_Motor 4 Motor-=Motor-_Motor 4 PWM=PWM4 ~DIR=~DIR4
Motor 10: designators end in _Motor_10; ports +5V=+5V Batt+=+24V DIR=DIR10 Disable=KILL Motor+=Motor+_Motor 10 Motor-=Motor-_Motor 10 PWM=PWM10 ~DIR=~DIR10
Motor 5: designators end in _Motor_5; ports +5V=+5V Batt+=+24V DIR=DIR5 Disable=KILL Motor+=Motor+_Motor 5 Motor-=Motor-_Motor 5 PWM=PWM5 ~DIR=~DIR5
Motor 11: designators end in _Motor_11; ports +5V=+5V Batt+=+24V DIR=DIR11 Disable=KILL Motor+=Motor+_Motor 11 Motor-=Motor-_Motor 11 PWM=PWM11 ~DIR=~DIR11

### Library data of the parts
C7 C9 C11 = Capacitor (non-polarized): Capacitor; Value: .1uF
C10 = Capacitor (polarized)
C13 C14 = Capacitor (non-polarized): Capacitor; Value: .1uF
D1 D2 = D Schottky: Schottky Diode; Published: 8-Jun-2000; LatestRevisionDate: 17-Jul-2002; LatestRevisionNote: Re-released for DXP Platform.; PackageReference: SMB; Publisher: Altium Limited; Code_JEDEC: DO-214-AA
LED2 = LED: Standard LED
R3 = Resistor: Value: 0Ohm
U4 = MC33886VW: Motor Controller

## Nets that join several sheets
+5V: Kanaloa_v2.0.0_Motor (7 pins), Microcontroller (34 pins), CurrentSense (15 pins), Motor 0 (15 pins), Motor 6 (15 pins), Motor 1 (15 pins), Motor 7 (15 pins), Motor 2 (15 pins), Motor 8 (15 pins), Motor 3 (15 pins), Motor 9 (15 pins), Motor 4 (15 pins), Motor 10 (15 pins), Motor 5 (15 pins), Motor 11 (15 pins)